# Altium schematic sheet Power Path Controllers.SchDoc
size E
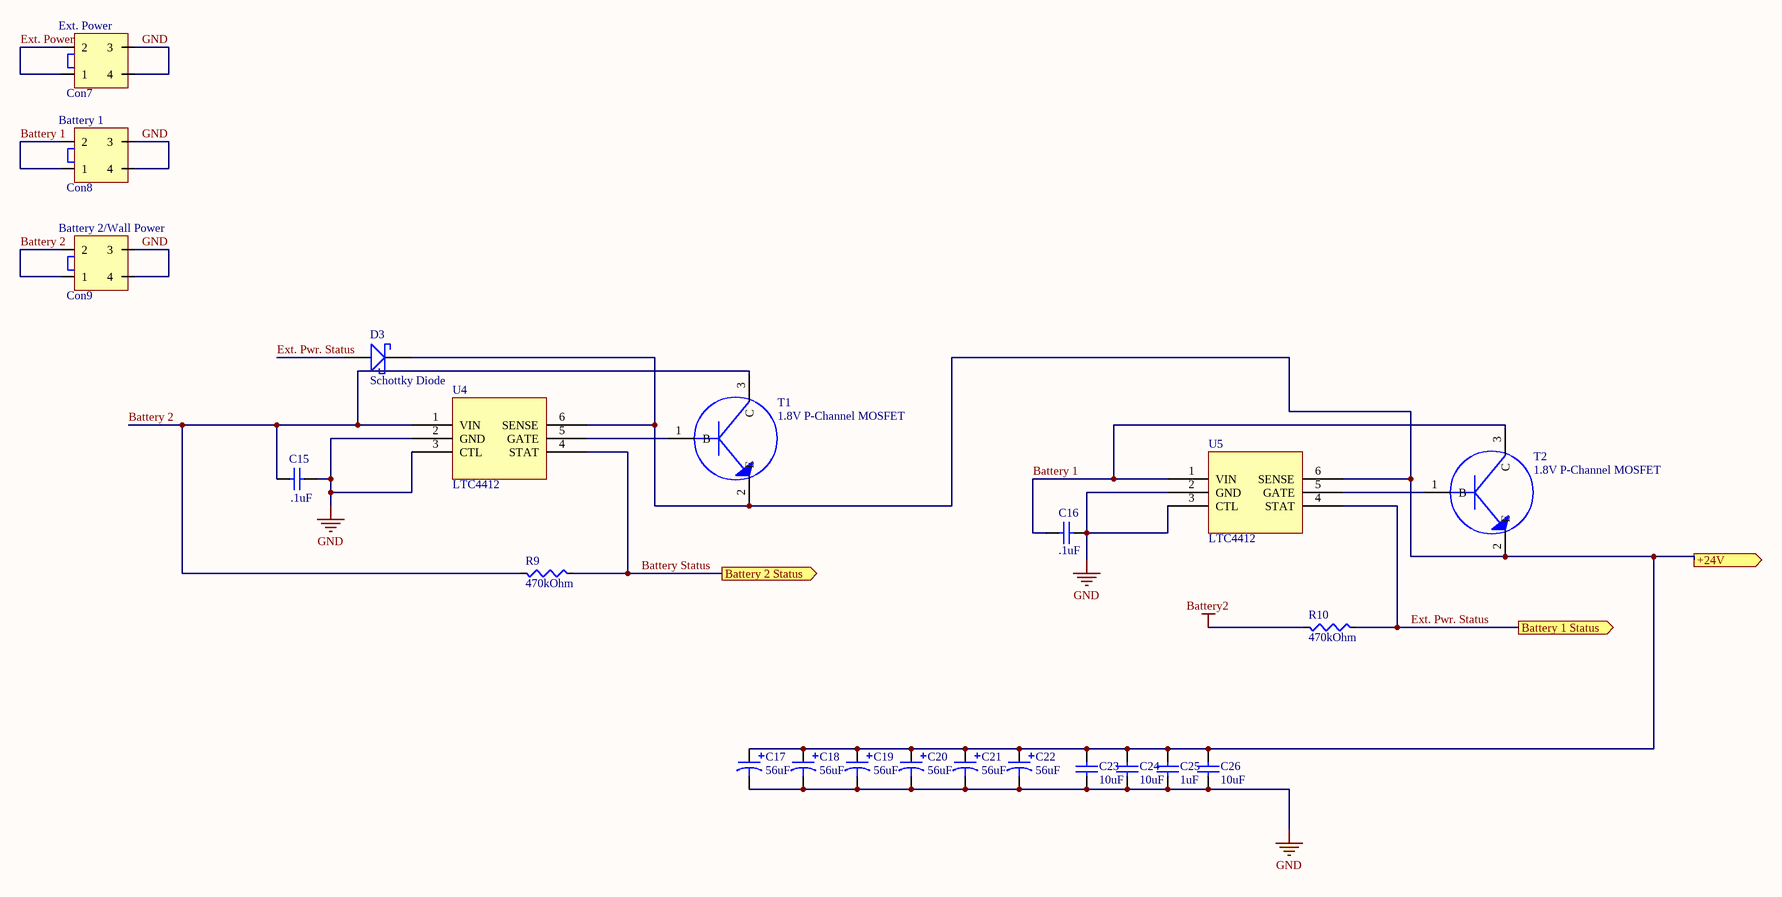
[diagram p0: Power Path Controllers.SchDoc]

## Parts
C15  .1uF  [0805 (2012) Capacitor]
C16  .1uF  [0805 (2012) Capacitor]
C17  56uF  [Radial_8mmDia_SM_E]
C18  56uF  [Radial_8mmDia_SM_E]
C19  56uF  [Radial_8mmDia_SM_E]
C20  56uF  [Radial_8mmDia_SM_E]
C21  56uF  [Radial_8mmDia_SM_E]
C22  56uF  [Radial_8mmDia_SM_E]
C23  10uF  [0805 (2012) Capacitor]
C24  10uF  [0805 (2012) Capacitor]
C25  1uF  [0805 (2012) Capacitor]
C26  10uF  [0805 (2012) Capacitor]
Con7  Ext. Power  [5566-4]
Con8  Battery 1  [5566-4]
Con9  Battery 2/Wall Power  [5566-4]
D3  Schottky Diode  [DO-41]
R9  470kOhm  [R 0805 (2012) RESISTOR]
R10  470kOhm  [R 0805 (2012) RESISTOR]
T1  1.8V P-Channel MOSFET  [SOT23]
T2  1.8V P-Channel MOSFET  [SOT23]
U4  LTC4412  [SOT95P245X110-6N]
U5  LTC4412  [SOT95P245X110-6N]

## Ports
+24V (out), Battery 1 Status (out), Battery 2 Status (out)

## Nets
Battery2: R10.2
GND: C15.2 C16.2 C17.N C18.N C19.N C20.N C21.N C22.N C23.2 C24.2 C25.2 C26.2 Con7.3 Con7.4 Con8.3 Con8.4 Con9.3 Con9.4 U4.2(GND) U4.3(CTL) U5.2(GND) U5.3(CTL)
+24V: C17.P C18.P C19.P C20.P C21.P C22.P C23.1 C24.1 C25.1 C26.1 D3.K T1.2(E) T2.2(E) U4.6(SENSE) U5.6(SENSE) ; port +24V
Battery 1: C16.1 Con8.1 Con8.2 T2.3(C) U5.1(VIN)
Battery 2: C15.1 Con9.1 Con9.2 R9.2 T1.3(C) U4.1(VIN)
Battery Status: R9.1 U4.4(STAT) ; port Battery 2 Status
Ext. Power: Con7.1 Con7.2
Ext. Pwr. Status: D3.A R10.1 U5.4(STAT) ; port Battery 1 Status
NetT1_1: T1.1(B) U4.5(GATE)
NetT2_1: T2.1(B) U5.5(GATE)

## Library data of the parts
C15 C16 = Capacitor (non-polarized): Capacitor; Value: .1uF
C17-C22 = Capacitor (polarized)
C23-C26 = Capacitor (non-polarized): Capacitor; Value: .1uF
Con7-Con9 = 5566-4: 4.20mm (.165") Pitch Mini-Fit Jr.™ Header, Dual Row, Vertical, without Snap-in Plastic Peg PCB Lock, 4 Circuits, PA Polyamide Nylon 6/6 94V-2, Tin (Sn) Plating, without Drain Holes
R9 R10 = Resistor: Value: 0Ohm
T1 T2 = Transistor
U4 U5 = LTC4412: Low Loss Power Path Controller in Thin SOT